# EAGLE design MesschieberV4 (EAGLE 6.4)

## Sheet 1 of 4
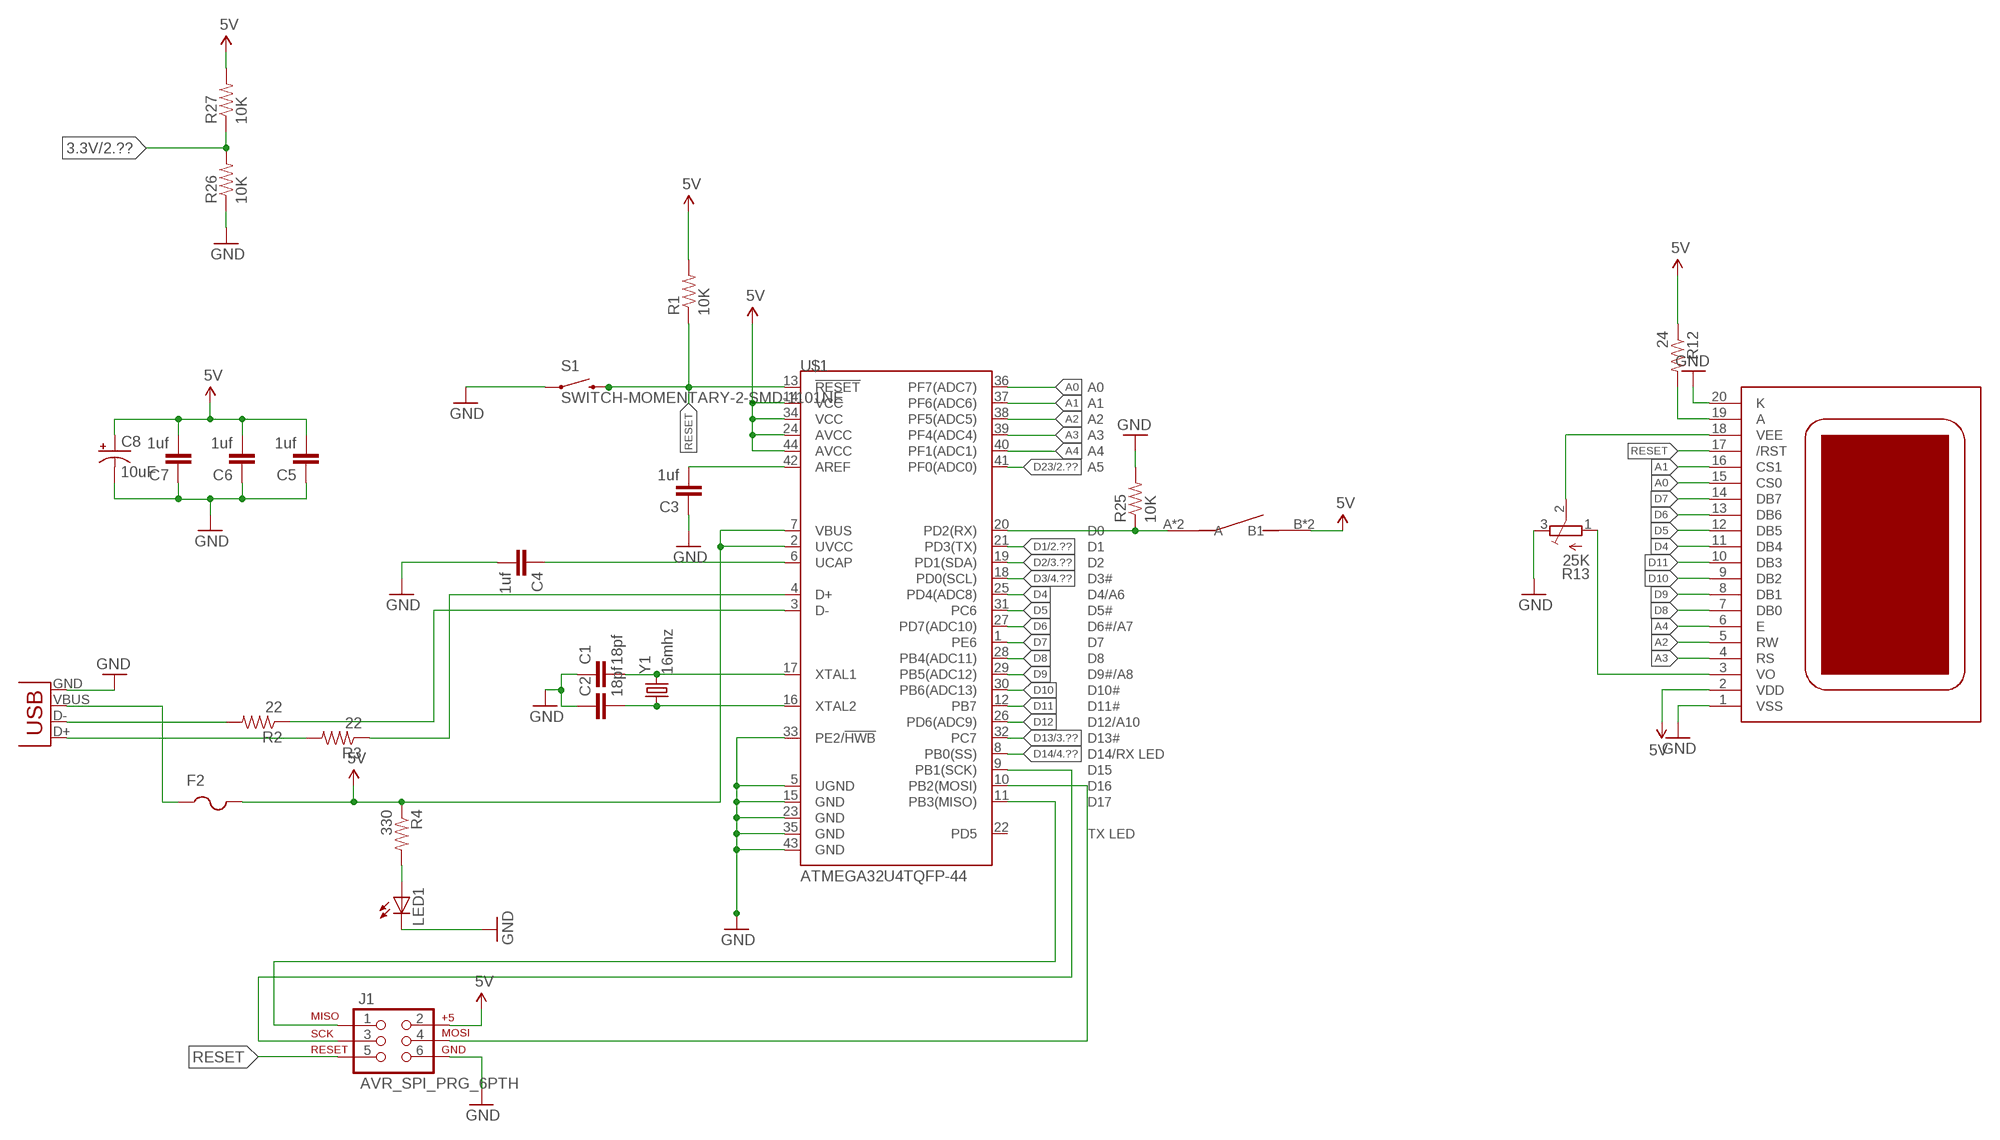
[diagram p0: schematic, sheet 1]

### Parts
C1  18pf  CAP0805  [0805]
C2  18pf  CAP0805  [0805]
C3  1uf  CAP0805  [0805]
C4  1uf  CAP0805  [0805]
C5  1uf  CAP0805  [0805]
C6  1uf  CAP0805  [0805]
C7  1uf  CAP0805  [0805]
C8  10uF  10UF-20V-10%(TANT)  [EIA3528]
F2  PTCFUSE-1812  [1812]
J1  AVR_SPI_PRG_6PTH  [2X3]
JP7  USB-SMD-NS  [USB-MINIB-NOSTOP]
LED1  LEDSML0805  [SML0805]
R1  10K  RESISTOR  [0805]
R2  22  RESISTOR  [0805]
R3  22  RESISTOR  [0805]
R4  330  RESISTOR  [0805]
R12  24  RESISTOR  [0805]
R13  25K  TRIM_EU-SM-42/43A  [SM-42/43A]
R25  10K  RESISTOR  [0805]
R26  10K  RESISTOR  [0805]
R27  10K  RESISTOR  [0805]
S1  SWITCH-MOMENTARY-2-SMD-1101NE  [TACTILE-SWITCH-1101NE]
U$1  ATMEGA32U4TQFP-44  [TQFP44]
U$2  TS12864A  [TS12864]
U$12  TASTE_R3FTL6  [TASTE_R3FTL6]
Y1  16mhz  CRYSTAL5X3  [CRYSTAL-SMD-5X3]

### Nets
3.3V: R26.2 R27.1 ; also sheet 2,3,4
5V: C5.2 C6.2 C7.2 C8.A(+) F2.2 J1.2 R1.2 R4.1 R12.1 R27.2 U$1.2(UVCC) U$1.7(VBUS) U$1.14(VCC) U$1.24(AVCC) U$1.34(VCC) U$1.44(AVCC) U$2.2(VDD) U$12.B1 U$12.B(B1) ; also sheet 2,3,4
A: R12.2 U$2.19(A)
A0: U$1.36(PF7(ADC7)) U$2.15(CS0)
A1: U$1.37(PF6(ADC6)) U$2.16(CS1)
A2: U$1.38(PF5(ADC5)) U$2.5(RW)
A3: U$1.39(PF4(ADC4)) U$2.4(RS)
A4: U$1.40(PF1(ADC1)) U$2.6(E)
D1: U$1.21(PD3(TX)) ; also sheet 2
D2: U$1.19(PD1(SDA)) ; also sheet 3
D3: U$1.18(PD0(SCL)) ; also sheet 4
D4: U$1.25(PD4(ADC8)) U$2.11(DB4)
D5: U$1.31(PC6) U$2.12(DB5)
D6: U$1.27(PD7(ADC10)) U$2.13(DB6)
D7: U$1.1(PE6) U$2.14(DB7)
D8: U$1.28(PB4(ADC11)) U$2.7(DB0)
D9: U$1.29(PB5(ADC12)) U$2.8(DB1)
D10: U$1.30(PB6(ADC13)) U$2.9(DB2)
D11: U$1.12(PB7) U$2.10(DB3)
D12: U$1.26(PD6(ADC9))
D13: U$1.32(PC7) ; also sheet 3
D14: U$1.8(PB0(SS)) ; also sheet 4
D23: U$1.41(PF0(ADC0)) ; also sheet 2
GND: C1.1 C2.1 C3.1 C4.2 C5.1 C6.1 C7.1 C8.C(-) J1.6 JP7.GND LED1.C R13.3(E) R25.2 R26.1 S1.P$1 U$1.5(UGND) U$1.15(GND) U$1.23(GND) U$1.33(PE2/!HWB) U$1.35(GND) U$1.43(GND) U$2.1(VSS) U$2.20(K) ; also sheet 2,3,4
N$1: C3.2 U$1.42(AREF)
N$2: C2.2 U$1.16(XTAL2) Y1.1
N$3: C1.2 U$1.17(XTAL1) Y1.3
N$5: JP7.D- R2.2
N$6: JP7.D+ R3.2
N$7: R3.1 U$1.4(D+)
N$8: R2.1 U$1.3(D-)
N$9: F2.1 JP7.VBUS
N$10: LED1.A R4.2
N$11: J1.3 U$1.9(PB1(SCK))
N$12: J1.1 U$1.11(PB3(MISO))
N$13: J1.4 U$1.10(PB2(MOSI))
N$14: C4.1 U$1.6(UCAP)
N$29: R25.1 U$1.20(PD2(RX)) U$12.A U$12.A1(A)
N$38: R13.1(A) U$2.3(VO)
RESET: J1.5 R1.1 S1.P$2 U$1.13(!RESET) U$2.17(/RST)
VEE: R13.2(S) U$2.18(VEE)
Unconnected: U$1.22(PD5)

## Sheet 2 of 4
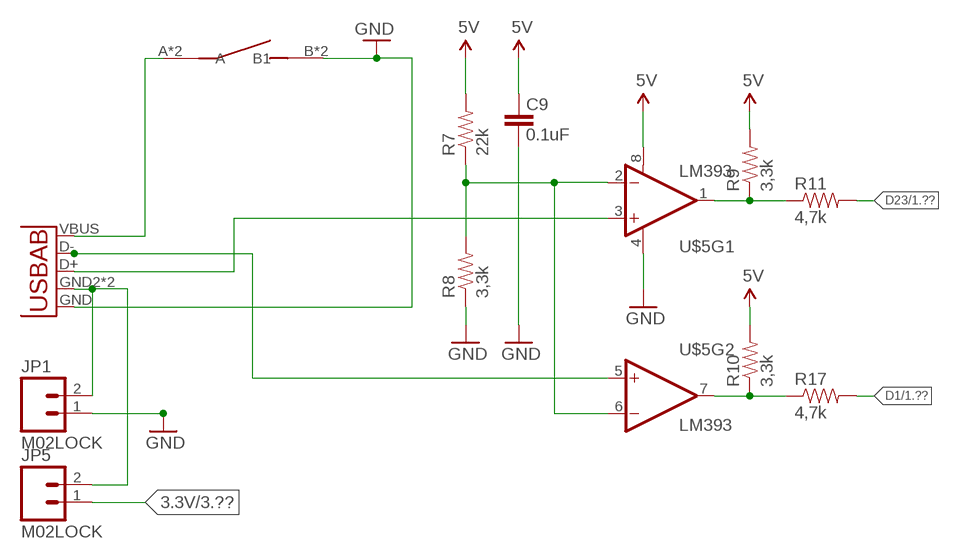
[diagram p1: schematic, sheet 2]

### Parts
C9  0.1uF  CAP0805  [0805]
JP1  M02LOCK  [1X02_LOCK]
JP5  M02LOCK  [1X02_LOCK]
R7  22k  RESISTOR  [0805]
R8  3,3k  RESISTOR  [0805]
R9  3,3k  RESISTOR  [0805]
R10  3,3k  RESISTOR  [0805]
R11  4,7k  RESISTOR  [0805]
R17  4,7k  RESISTOR  [0805]
U$3  TASTE_R3FTL6  [TASTE_R3FTL6]
U$5  LM393  [SO08]
U$7  USB-A  [USB-A]

### Nets
3.3V: JP5.1 ; also sheet 1,3,4
5V: C9.2 R7.2 R9.2 R10.2 U$5.8(V+) ; also sheet 1,3,4
D1: R17.2 ; also sheet 1
D23: R11.2 ; also sheet 1
DATA1: R9.1 R11.1 U$5.1(OUT)
GND: C9.1 JP1.1 R8.1 U$3.B1 U$3.B(B1) U$5.4(V-) U$7.GND ; also sheet 1,3,4
N$4: R7.1 R8.2 U$5.2(-IN) U$5.6(-IN)
N$15: U$5.3(+IN) U$7.D+
N$16: U$5.5(+IN) U$7.D-
N$17: U$3.A U$3.A1(A) U$7.VBUS
N$18: JP1.2 JP5.2 U$7.GND2(USBID) U$7.GND3(USBID)
SCK1: R10.1 R17.1 U$5.7(OUT)

## Sheet 3 of 4
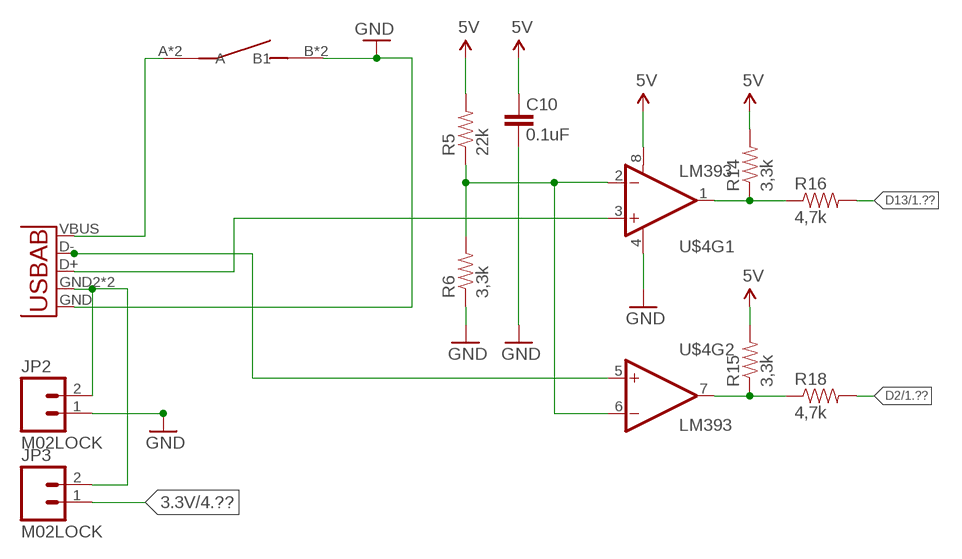
[diagram p2: schematic, sheet 3]

### Parts
C10  0.1uF  CAP0805  [0805]
JP2  M02LOCK  [1X02_LOCK]
JP3  M02LOCK  [1X02_LOCK]
R5  22k  RESISTOR  [0805]
R6  3,3k  RESISTOR  [0805]
R14  3,3k  RESISTOR  [0805]
R15  3,3k  RESISTOR  [0805]
R16  4,7k  RESISTOR  [0805]
R18  4,7k  RESISTOR  [0805]
U$4  LM393  [SO08]
U$6  USB-A  [USB-A]
U$8  TASTE_R3FTL6  [TASTE_R3FTL6]

### Nets
3.3V: JP3.1 ; also sheet 1,2,4
5V: C10.2 R5.2 R14.2 R15.2 U$4.8(V+) ; also sheet 1,2,4
D2: R18.2 ; also sheet 1
D13: R16.2 ; also sheet 1
DATA2: R14.1 R16.1 U$4.1(OUT)
GND: C10.1 JP2.1 R6.1 U$4.4(V-) U$6.GND U$8.B1 U$8.B(B1) ; also sheet 1,2,4
N$19: R5.1 R6.2 U$4.2(-IN) U$4.6(-IN)
N$20: U$4.3(+IN) U$6.D+
N$21: U$4.5(+IN) U$6.D-
N$22: U$6.VBUS U$8.A U$8.A1(A)
N$23: JP2.2 JP3.2 U$6.GND2(USBID) U$6.GND3(USBID)
SCK2: R15.1 R18.1 U$4.7(OUT)

## Sheet 4 of 4
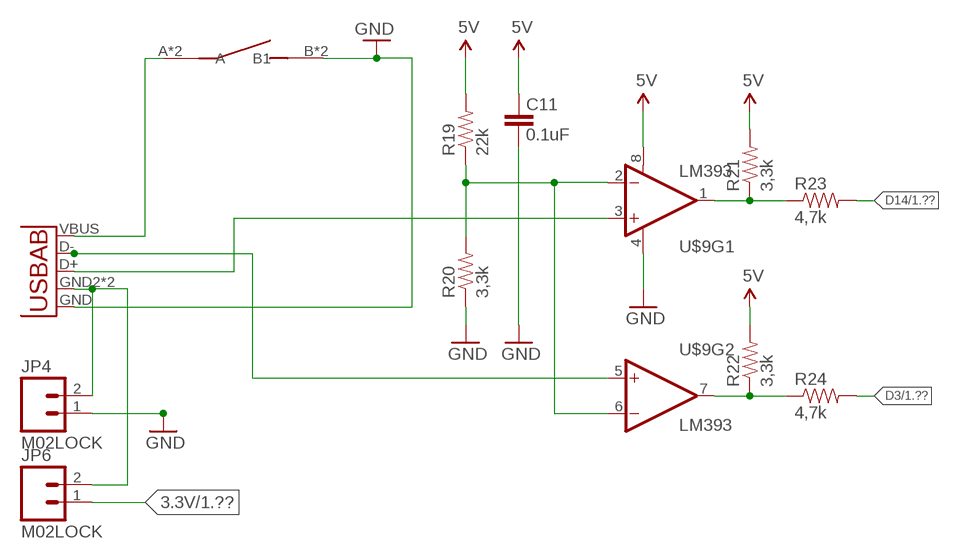
[diagram p3: schematic, sheet 4]

### Parts
C11  0.1uF  CAP0805  [0805]
JP4  M02LOCK  [1X02_LOCK]
JP6  M02LOCK  [1X02_LOCK]
R19  22k  RESISTOR  [0805]
R20  3,3k  RESISTOR  [0805]
R21  3,3k  RESISTOR  [0805]
R22  3,3k  RESISTOR  [0805]
R23  4,7k  RESISTOR  [0805]
R24  4,7k  RESISTOR  [0805]
U$9  LM393  [SO08]
U$10  USB-A  [USB-A]
U$11  TASTE_R3FTL6  [TASTE_R3FTL6]

### Nets
3.3V: JP6.1 ; also sheet 1,2,3
5V: C11.2 R19.2 R21.2 R22.2 U$9.8(V+) ; also sheet 1,2,3
D3: R24.2 ; also sheet 1
D14: R23.2 ; also sheet 1
DATA3: R21.1 R23.1 U$9.1(OUT)
GND: C11.1 JP4.1 R20.1 U$9.4(V-) U$10.GND U$11.B1 U$11.B(B1) ; also sheet 1,2,3
N$24: R19.1 R20.2 U$9.2(-IN) U$9.6(-IN)
N$25: U$9.3(+IN) U$10.D+
N$26: U$9.5(+IN) U$10.D-
N$27: U$10.VBUS U$11.A U$11.A1(A)
N$28: JP4.2 JP6.2 U$10.GND2(USBID) U$10.GND3(USBID)
SCK3: R22.1 R24.1 U$9.7(OUT)

## Library data of the parts
C1-C7 = SparkFun-Capacitors:CAP: Capacitor Standard 0603 ceramic capacitor, and 0.1" leaded capacitor.
C8 = SparkFun-Capacitors:10UF-20V-10%(TANT): CAP-08063; PROD_ID: CAP-08063
C9-C11 = SparkFun:CAP: Capacitor Standard 0603 ceramic capacitor, and 0.1" leaded capacitor.
F2 = adafruit:PTCFUSE: PTC fuses, resettable thermistors
J1 = SparkFun-Connectors:AVR_SPI_PRG_6: AVR ISP 6 Pin This is the reduced ISP connector for AVR programming. Common on Arduino. This footprint will take up less PCB space and can be used with a 10-pin to 6-pin adapter such as SKU: BOB-08508
JP1-JP6 = SparkFun-Connectors:M02: Standard 2-pin 0.1" header. Use with - straight break away headers ( PRT-00116) - right angle break away headers (PRT-00553) - swiss pins (PRT-00743) - machine pins (PRT-00117) - female headers (PRT-00115) Molex polarized connector foot print use with: PRT-08233 with associated crimp pins and housings. 2.54_SCREWTERM for use with PRT-10571. 3.5mm Screw Terminal footprints for PRT-08084 5mm Screw Terminal footprints for use with PRT-08433
JP7 = SparkFun-Connectors:USB: USB Connectors USB-B-PTH is fully proven SKU : PRT-00139/CONN-08278 USB-miniB is fully proven SKU : PRT-00587 USB-A-PCB is untested. USB-A-H is throughly reviewed, but untested. Spark Fun Electronics SKU : PRT-00437 USB-B-SMT is throughly reviewed, but untested. Needs silkscreen touching up. USB-A-S has not been used/tested USB-MB-H has not been used/tested USB-MICROB has been used. CONN-09505
LED1 = led:LED: LED OSRAM: - CHIPLED LG R971, LG N971, LY N971, LG Q971, LY Q971, LO R971, LY R971 LH N974, LH R974 LS Q976, LO Q976, LY Q976 LO Q996 - Hyper CHIPLED LW Q18S LB Q993, LB Q99A, LB R99A - SideLED LS A670, LO A670, LY A670, LG A670, LP A670 LB A673, LV A673, LT A673, LW A673 LH A674 LY A675 LS A676, LA A676, LO A676, LY A676, LW A676 LS A679, LY A679, LG A679 - Hyper Micro SIDELED® LS Y876, LA Y876, LO Y876, LY Y876 LT Y87S - SmartLED LW L88C, LW L88S LB L89C, LB L89S, LG L890 LS L89K, LO L89K, LY L89K LS L896, LA L896, LO L896, LY L896 - TOPLED LS T670, LO T670, LY T670, LG T670, LP T670 LSG T670, LSP T670, LSY T670, LOP T670, LYG T670 LG T671, LOG T671, LSG T671 LB T673, LV T673, LT T673, LW T673 LH T674 LS T676, LA T676, LO T676, LY T676, LB T676, LH T676, LSB T676, LW T676 LB T67C, LV T67C, LT T67C, LS T67K, LO T67K, LY T67K, LW E67C LS E67B, LA E67B, LO E67B, LY E67B, LB E67C, LV E67C, LT E67C LW T67C LS T679, LY T679, LG T679 LS T770, LO T770, LY T770, LG T770, LP T770 LB T773, LV T773, LT T773, LW T773 LH T774 LS E675, LA E675, LY E675, LS T675 LS T776, LA T776, LO T776, LY T776, LB T776 LHGB T686 LT T68C, LB T68C - Hyper Mini TOPLED® LB M676 - Mini TOPLED Santana® LG M470 LS M47K, LO M47K, LY M47K Source: http://www.osram.convergy.de LUXEON: - LUMILED® LXK2-PW12-R00, LXK2-PW12-S00, LXK2-PW14-U00, LXK2-PW14-V00 LXK2-PM12-R00, LXK2-PM12-S00, LXK2-PM14-U00 LXK2-PE12-Q00, LXK2-PE12-R00, LXK2-PE12-S00, LXK2-PE14-T00, LXK2-PE14-U00 LXK2-PB12-K00, LXK2-PB12-L00, LXK2-PB12-M00, LXK2-PB14-N00, LXK2-PB14-P00, LXK2-PB14-Q00 LXK2-PR12-L00, LXK2-PR12-M00, LXK2-PR14-Q00, LXK2-PR14-R00 LXK2-PD12-Q00, LXK2-PD12-R00, LXK2-PD12-S00 LXK2-PH12-R00, LXK2-PH12-S00 LXK2-PL12-P00, LXK2-PL12-Q00, LXK2-PL12-R00 Source: www.luxeon.com KINGBRIGHT: KA-3528ASYC Source: www.kingbright.com
R1-R12 R14-R27 = SparkFun:RESISTOR: Resistor Basic schematic elements and footprints for 0603, 1206, and PTH 1/10th watt (small) resistors.
R13 = pot:TRIM_EU-: POTENTIOMETER
S1 = SparkFun-Electromechanical:SWITCH-MOMENTARY-2: Various NO switches- pushbuttons, reed, etc
U$1 = SparkFun-DigitalIC:ATMEGA32U4: Atmel 44-pin 8-bit Microcontroller with 32KBytes of ISP Flash and USB Controller
U$2 = adafruit:TS12864A: KS0108 based display. Some have slightly different pinouts so double check!
U$3 U$8 U$11 U$12 = andi:TASTE_R3FTL6: http://www.reichelt.de/Kurzhubtaster/TASTER-3FTL6/3/index.html?&ACTION=3&LA=2&ARTICLE=79697&GROUPID=3278&artnr=TASTER+3FTL6
U$4 U$5 U$9 = SparkFun-AnalogIC:LM393: Low-voltage comparator
U$6 U$7 U$10 = andi:USB-A
Y1 = SparkFun-FreqCtrl:CRYSTAL: Various standard crystals. Proven footprints. Spark Fun Electronics SKU : COM-00534

## Net classes
0 default: width 0.203 mm, clearance 0.205 mm
1 vcc: width 0.254 mm, clearance 0.205 mm to class 0, clearance 0.205 mm

## Board
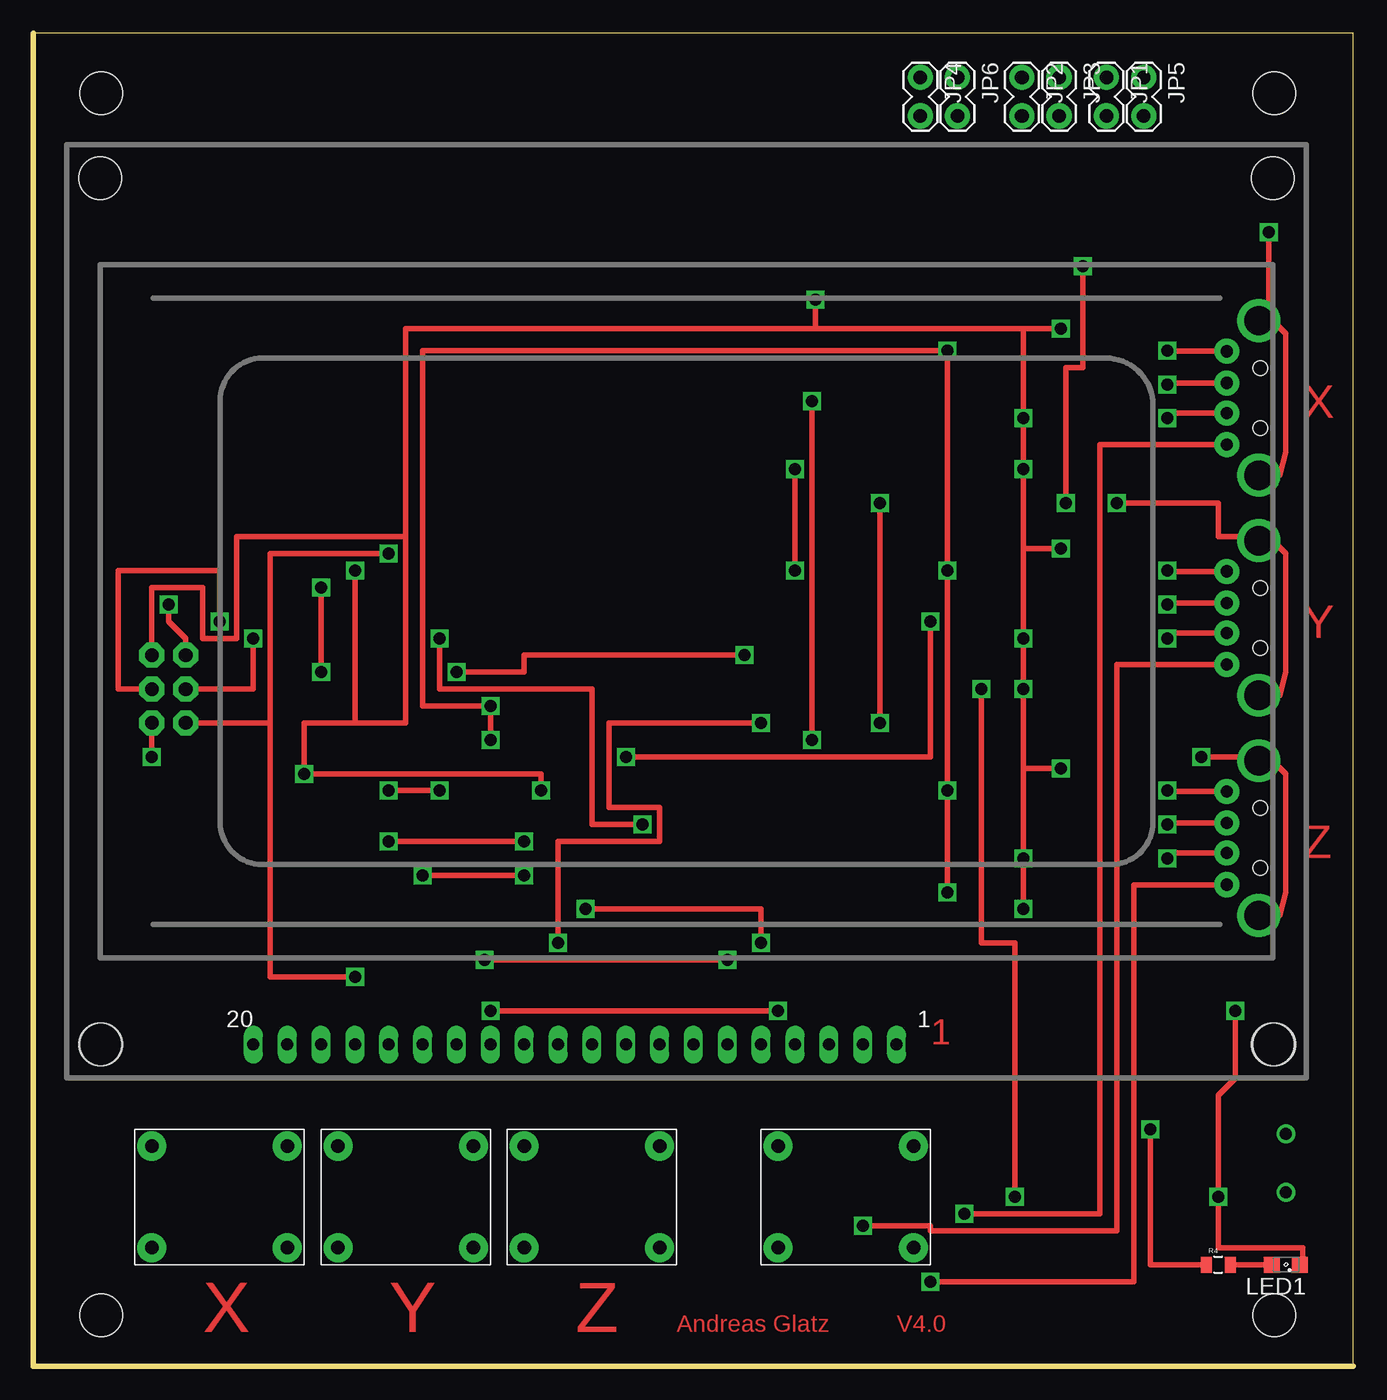
[diagram p4: board, top side]
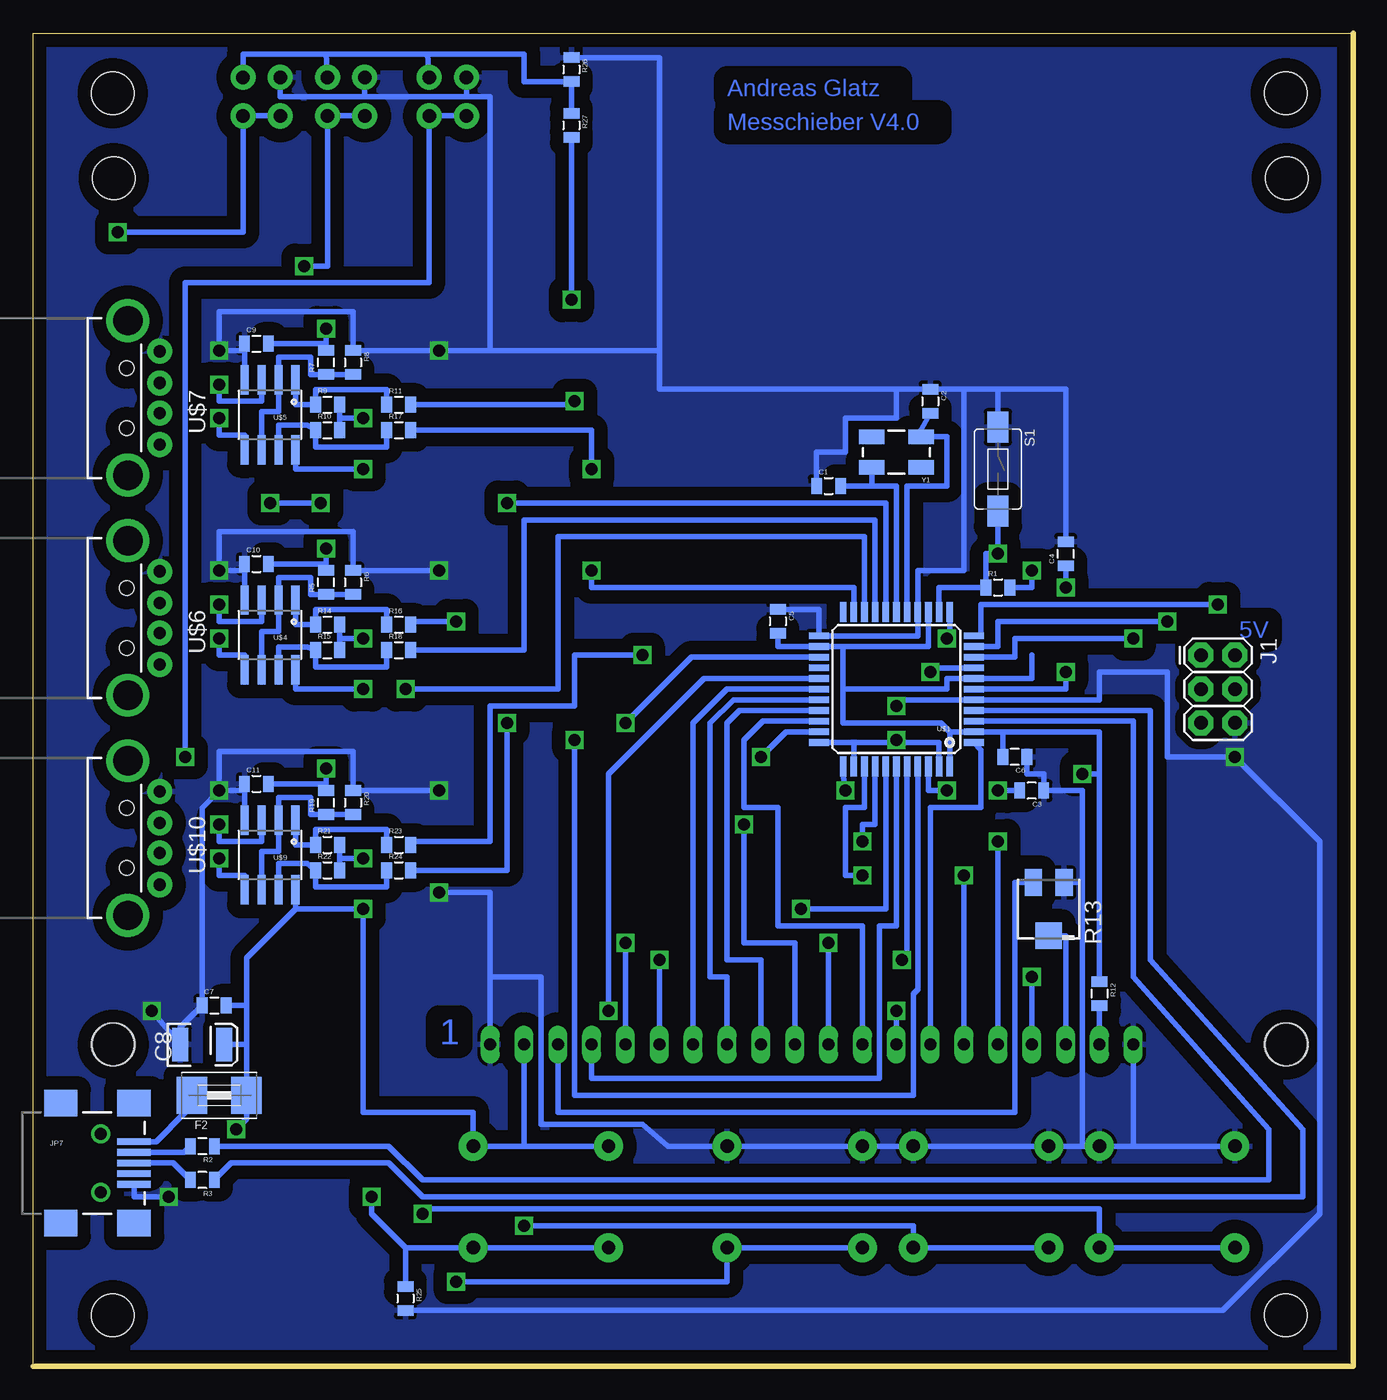
[diagram p5: board, bottom side, seen from below]

Size 99.04 x 100 mm. Coordinates in mm from the lower left corner, seen from the top.
Outline: 0,0 99.04,0 99.04,100 0,100 0,0
Copper layers (1*16): Top 0.035mm / dielectric 1.5mm / Bottom 0.035mm
Design rules "default": minimum track width 10mil, minimum drill 24mil, track to track 8mil, track to pad 8mil, pad to pad 8mil, via to via 8mil, smd to smd 8mil, copper to edge 40mil, drill to drill 8mil, minimum pad ring 10mil, minimum via ring 8mil, stop-mask expansion 4mil, vias tented up to drill 0mil, thermal gap 10mil
Holes 3.2 mm at 5.08,95.5 93.09,95.5 93.09,24.13 5.08,24.13 5.08,3.81 93.09,3.81

### Footprints (pad centres in the part's own frame; a part is rotated, then mirrored left to right if it is on the bottom)
0805 = smd 0.8 x 1.2: 1 -0.9,0; 2 0.9,0
EIA3528 = smd 1.2 x 2.5: A 1.65,0; C -1.65,0
1812 = smd 2.286 x 2.794: 1 -2.046,0; 2 2.046,0
2X3 = drill 1.016 pad 1.88 octagon: 1 0,0; 2 0,2.54; 3 2.54,0; 4 2.54,2.54; 5 5.08,0; 6 5.08,2.54
1X02_LOCK = drill 1.016 pad 1.88: 1 -0.178,0; 2 2.718,0
USB-MINIB-NOSTOP = smd 2.5 x 0.5: D+ 2.5,0; D- 2.5,0.8; GND 2.5,-1.6; ID 2.5,-0.8; VBUS 2.5,1.6 | smd 2.5 x 2: G1 -3,-4.5; G2 -3,4.5; G3 2.5,4.5; G4 2.5,-4.5 | drill 0.9 pad 0.8: H1 0,2.2 | drill 0.9 pad 0.787: H2 0,-2.2
SML0805 = smd 1.2 x 1.2: A 1.05,0; C -1.05,0
SM-42/43A = smd 2 x 1.3: 1 2,1.15; 3 2,-1.15 | smd 2 x 2: 2 -2,0
TACTILE-SWITCH-1101NE = smd 2.3 x 1.6: P$1 -3.15,0; P$2 3.15,0
TQFP44 = smd 1.5 x 0.5: 1 -5.8,4; 2 -5.8,3.2; 3 -5.8,2.4; 4 -5.8,1.6; 5 -5.8,0.8; 6 -5.8,0; 7 -5.8,-0.8; 8 -5.8,-1.6; 9 -5.8,-2.4; 10 -5.8,-3.2; 11 -5.8,-4; 23 5.8,-4; 24 5.8,-3.2; 25 5.8,-2.4; 26 5.8,-1.6; 27 5.8,-0.8; 28 5.8,0; 29 5.8,0.8; 30 5.8,1.6; 31 5.8,2.4; 32 5.8,3.2; 33 5.8,4 | smd 0.5 x 1.5: 12 -4,-5.8; 13 -3.2,-5.8; 14 -2.4,-5.8; 15 -1.6,-5.8; 16 -0.8,-5.8; 17 0,-5.8; 18 0.8,-5.8; 19 1.6,-5.8; 20 2.4,-5.8; 21 3.2,-5.8; 22 4,-5.8; 34 4,5.8; 35 3.2,5.8; 36 2.4,5.8; 37 1.6,5.8; 38 0.8,5.8; 39 0,5.8; 40 -0.8,5.8; 41 -1.6,5.8; 42 -2.4,5.8; 43 -3.2,5.8; 44 -4,5.8
TS12864 = drill 0.9 long: 1 48.26,0; 2 45.72,0; 3 43.18,0; 4 40.64,0; 5 38.1,0; 6 35.56,0; 7 33.02,0; 8 30.48,0; 9 27.94,0; 10 25.4,0; 11 22.86,0; 12 20.32,0; 13 17.78,0; 14 15.24,0; 15 12.7,0; 16 10.16,0; 17 7.62,0; 18 5.08,0; 19 2.54,0; 20 0,0 | hole 3.2: -11.5,65; 76.5,65; -11.5,0; 76.5,0
TASTE_R3FTL6 = drill 1 pad 2.184: A -1.27,0; A1 8.89,0; B 8.89,7.62; B1 -1.27,7.62
SO08 = smd 0.61 x 2.21: 1 -1.905,-2.616; 2 -0.635,-2.616; 3 0.635,-2.616; 4 1.905,-2.616; 5 1.905,2.616; 6 0.635,2.616; 7 -0.635,2.616; 8 -1.905,2.616
USB-A = drill 0.914 pad 1.88: D+ 10.02,1.127; D- 10.02,-1.127; GND 10.02,3.5; VBUS 10.02,-3.5 | drill 2.2: GND2 7.62,-5.8; GND3 7.62,5.8 | hole 1.1: 7.52,2.25; 7.52,-2.25
CRYSTAL-SMD-5X3 = smd 1.9 x 1.1: 1 -1.85,-1.15; 2 1.85,-1.15; 3 1.85,1.15; 4 -1.85,1.15

### Placement (x,y rotation side)
C1  39.37,66.04 0 bottom
C2  31.75,72.39 270 bottom
C3  24.13,43.18 180 bottom
C4  21.59,60.96 90 bottom
C5  43.18,55.88 270 bottom
C6  25.4,45.72 180 bottom
C7  85.47,27.05 0 bottom
C8  86.36,24.13 0 bottom
C9  82.3,76.71 0 bottom
C10  82.3,60.2 0 bottom
C11  82.3,43.69 0 bottom
F2  85.09,20.32 0 bottom
J1  11.43,53.34 270 bottom
JP1  80.52,96.52 270 top
JP2  74.17,96.52 270 top
JP3  76.96,96.52 270 top
JP4  66.55,96.52 270 top
JP5  83.31,96.52 270 top
JP6  69.34,96.52 270 top
JP7  93.98,15.24 0 bottom
LED1  93.98,7.62 180 top
R1  26.67,58.42 0 bottom
R2  86.36,16.51 180 bottom
R3  86.36,13.97 180 bottom
R4  88.9,7.62 0 top
R5  77.09,58.8 90 bottom
R6  75.06,58.8 270 bottom
R7  77.09,75.31 90 bottom
R8  75.06,75.31 270 bottom
R9  76.96,72.14 0 bottom
R10  76.96,70.23 0 bottom
R11  71.63,72.14 0 bottom
R12  19.05,27.94 270 bottom
R13  22.86,34.29 90 bottom
R14  76.96,55.63 0 bottom
R15  76.96,53.72 0 bottom
R16  71.63,55.63 0 bottom
R17  71.63,70.23 0 bottom
R18  71.63,53.72 0 bottom
R19  77.09,42.29 90 bottom
R20  75.06,42.29 270 bottom
R21  76.96,39.12 0 bottom
R22  76.96,37.21 0 bottom
R23  71.63,39.12 0 bottom
R24  71.63,37.21 0 bottom
R25  71.12,5.08 270 bottom
R26  58.67,97.28 270 bottom
R27  58.67,93.09 270 bottom
S1  26.67,67.31 270 bottom
U$1  34.29,50.8 180 bottom
U$2  16.51,24.13 0 top
U$3  10.16,8.89 0 top
U$4  81.28,54.86 180 bottom
U$5  81.28,71.37 180 bottom
U$6  99.57,56.13 0 bottom
U$7  99.57,72.64 0 bottom
U$8  24.13,8.89 0 top
U$9  81.28,38.35 180 bottom
U$10  99.57,39.62 0 bottom
U$11  38.1,8.89 0 top
U$12  57.15,8.89 0 top
Y1  34.29,68.58 180 bottom

### Tracks (layer width: path | path; a pad name or v marks a point on that pad's centre or on a via)
3.3V
  Bottom 0.406: JP5.1 83.31,98.42 77.09,98.42 | JP3.1 77.09,98.42 | 77.09,98.42 69.47,98.42 | JP6.1 69.47,98.42 | 69.47,98.42 62.23,98.42 62.23,96.38 R26.2 R27.1
5V  (via drill 0.9)
  Top 0.406: v24.13,59.69 24.13,48.26 | 24.13,48.26 20.32,48.26 v20.32,44.45 38.1,44.45 v38.1,43.18 | v77.09,77.85 74.3,77.85 | 74.3,77.85 v74.3,71.12 v74.3,67.31 74.3,61.34 | v77.09,61.34 74.3,61.34 | 74.3,61.34 v74.3,54.61 v74.3,50.8 74.3,44.83 | v74.3,34.29 v74.3,38.1 74.3,44.83 | v77.09,44.83 74.3,44.83 | 74.3,77.85 58.67,77.85 | 58.67,77.85 v58.67,80.01 | 58.67,77.85 27.94,77.85 27.94,62.23 | 27.94,62.23 27.94,48.26 24.13,48.26 | J1.2 8.89,58.42 12.7,58.42 12.7,54.61 15.24,54.61 15.24,62.23 27.94,62.23 | v83.82,17.78 83.82,7.62 R4.1
  Bottom 0.406: U$1.2 30.29,47.6 | U$1.2 26.3,47.6 C6.2 | 24.13,53.34 24.13,51.6 U$1.7 30.48,51.6 30.48,50.8 38.29,50.8 | U$1.2 19.05,47.6 R12.1 19.05,44.45 v20.32,44.45 | 38.29,54 U$1.24 43.18,54 C5.2 | 38.29,54 38.29,50.8 | U$1.14 31.89,54 38.29,54 | U$1.44 30.29,47.6 | 38.29,50.8 38.29,48.26 30.95,48.26 30.29,47.6 | U$1.34 38.29,44.45 v38.1,43.18 | R1.2 24.13,58.42 v24.13,59.69 | R9.2 R10.2 76.06,69.85 76.07,69.85 76.07,71.12 v74.3,71.12 | C9.2 77.09,76.71 R7.2 v77.09,77.85 | U$5.8 79.38,67.31 v74.3,67.31 | R14.2 R15.2 76.06,53.34 76.07,53.34 76.07,54.61 v74.3,54.61 | C10.2 77.09,60.2 R5.2 v77.09,61.34 | U$4.8 79.38,50.8 v74.3,50.8 | R21.2 R22.2 76.06,36.83 76.07,36.83 76.07,38.1 v74.3,38.1 | C11.2 77.09,43.69 R19.2 v77.09,44.83 | U$9.8 79.38,34.29 | 79.38,34.29 v74.3,34.29 74.3,19.05 66.04,19.05 U$12.B 62.23,16.51 | R27.2 v58.67,80.01 | U$2.2 62.23,16.51 | 62.23,16.51 U$12.B1 | F2.2 83.04,27.05 | 79.38,34.29 83.04,30.62 83.04,27.05 | F2.2 83.04,24.13 C8.A | 83.04,27.05 C7.2 | F2.2 83.04,18.56 v83.82,17.78
A
  Bottom 0.406: U$2.19 R12.2
A0  (via drill 0.9)
  Top 0.406: v36.83,36.83 v29.21,36.83
  Bottom 0.406: U$1.36 36.69,41.91 38.1,41.91 38.1,36.83 v36.83,36.83 | v29.21,36.83 U$2.15
A1  (via drill 0.9)
  Top 0.406: v36.83,39.37 v26.67,39.37
  Bottom 0.406: U$1.37 35.89,40.64 36.83,40.64 v36.83,39.37 | v26.67,39.37 U$2.16
A2  (via drill 0.9)
  Top 0.406: v54.61,31.75 54.61,34.29 v41.44,34.29
  Bottom 0.406: v54.61,31.75 U$2.5 | U$1.38 35.09,34.29 v41.44,34.29
A3
  Bottom 0.406: U$1.39 34.29,33.02 35.56,33.02 35.56,21.59 57.15,21.59 U$2.4
A4  (via drill 0.9)
  Top 0.406: v33.87,30.48 v52.07,30.48
  Bottom 0.406: v52.07,30.48 U$2.6 | U$1.40 33.49,30.86 v33.87,30.48
D1  (via drill 0.9)
  Top 0.406: v57.15,59.69 v57.15,67.31
  Bottom 0.406: U$1.21 37.49,58.42 57.15,58.42 v57.15,59.69 | v57.15,67.31 57.15,70.23 R17.2
D2
  Bottom 0.406: U$1.19 35.89,63.5 62.23,63.5 62.23,53.72 R18.2
D3  (via drill 0.9)
  Top 0.406: v63.5,48.26 v63.5,64.77
  Bottom 0.406: U$1.18 35.09,64.77 v63.5,64.77 | R24.2 63.5,37.21 v63.5,48.26
D4  (via drill 0.9)
  Top 0.406: v54.61,48.26 43.18,48.26 43.18,41.91 46.99,41.91 46.99,39.37 39.37,39.37 v39.37,31.75
  Bottom 0.406: U$1.25 49.67,53.2 v54.61,48.26 | v39.37,31.75 U$2.11
D5
  Bottom 0.406: U$1.31 44.31,48.4 45.72,46.99 45.72,41.91 43.18,41.91 43.18,33.02 36.83,33.02 U$2.12
D6  (via drill 0.9)
  Top 0.406: v34.29,26.67 v55.88,26.67
  Bottom 0.406: U$1.27 48.73,51.6 55.88,44.45 v55.88,26.67 | U$2.13 v34.29,26.67
D7
  Bottom 0.406: U$2.14 31.75,41.91 27.94,41.91 27.94,46.25 U$1.1
D8
  Bottom 0.406: U$2.7 49.53,48.26 46.99,50.8 U$1.28
D9
  Bottom 0.406: U$1.29 46.52,50 48.26,48.26 48.26,29.21 46.99,29.21 U$2.8
D10
  Bottom 0.406: U$1.30 46.05,49.2 46.99,48.26 46.99,30.48 44.45,30.48 U$2.9
D11  (via drill 0.9)
  Top 0.406: v45.72,40.64 41.91,40.64 41.91,50.8 30.48,50.8 v30.48,54.61
  Bottom 0.406: v45.72,40.64 45.72,31.75 41.91,31.75 U$2.10 | U$1.12 30.29,54.61 v30.48,54.61
D13  (via drill 0.9)
  Top 0.406: v44.45,45.72 67.31,45.72 v67.31,55.88
  Bottom 0.406: U$1.32 42.57,47.6 v44.45,45.72 | v67.31,55.88 70.73,55.88 R16.2
D14  (via drill 0.9)
  Top 0.406: v31.75,52.07 36.83,52.07 36.83,53.34 v53.34,53.34
  Bottom 0.406: U$1.8 31.75,52.4 v31.75,52.07 | v53.34,53.34 58.42,53.34 58.42,49.53 64.77,49.53 64.77,39.37 70.47,39.37 R23.2
D23  (via drill 0.9)
  Top 0.406: v58.42,46.99 v58.42,72.39
  Bottom 0.406: v58.42,46.99 58.42,20.32 33.02,20.32 33.02,27.94 32.69,28.27 U$1.41 | R11.2 58.42,72.14 v58.42,72.39
DATA1
  Bottom 0.406: U$5.1 79.38,72.14 R9.1 77.86,73.28 72.53,73.28 R11.1
DATA2
  Bottom 0.406: U$4.1 79.38,55.63 R14.1 77.86,56.77 72.53,56.77 R16.1
DATA3
  Bottom 0.406: U$9.1 79.38,39.12 R21.1 77.86,40.26 72.53,40.26 R23.1
GND  (via drill 0.9)
  Top 0.406: v34.29,46.99 v34.29,49.53 29.21,49.53 29.21,76.2 v68.58,76.2 v68.58,59.69 v68.58,43.18 v68.58,35.56 | U$7.GND 85.09,76.14 v85.09,76.2 | U$6.GND 85.09,59.63 v85.09,59.69 | U$10.GND 85.09,43.12 v85.09,43.18 | J1.6 v8.89,45.72 | LED1.C 95.25,7.62 95.25,8.89 88.9,8.89 v88.9,12.7 88.9,20.32 90.17,21.59 v90.17,26.67
  Bottom 0.406: C1.1 40.27,68.58 38.1,68.58 38.1,71.12 34.29,71.12 34.29,73.29 | C6.1 24.5,44.45 23.23,44.45 C3.1 20.32,43.18 20.32,36.29 | U$1.43 31.09,46.8 34.29,46.8 | 34.29,46.8 37.49,46.8 | 37.49,46.8 U$1.33 | U$1.35 37.49,46.8 | v34.29,46.99 34.29,46.8 | C5.1 40.09,56.78 U$1.23 32.69,54.8 U$1.15 32.69,59.69 29.21,59.69 29.21,73.29 C2.1 | C4.2 21.59,73.29 26.67,73.29 | 26.67,73.29 C2.1 | 83.2,76.2 v85.09,76.2 85.09,79.12 75.06,79.12 R8.1 v68.58,76.2 64.77,76.2 | 83.2,76.2 C9.1 | U$5.4 83.2,76.2 | 83.2,59.69 v85.09,59.69 85.09,62.61 75.06,62.61 R6.1 v68.58,59.69 | 83.2,59.69 C10.1 | U$4.4 83.2,59.69 | v85.09,43.18 83.2,43.18 | 83.2,43.18 C11.1 | U$9.4 83.2,43.18 | v85.09,43.18 85.09,46.1 75.06,46.1 R20.1 v68.58,43.18 | JP4.1 66.55,95.25 | JP2.1 74.17,95.25 | 74.17,95.25 80.52,95.25 JP1.1 | 66.55,95.25 64.77,95.25 64.77,76.2 | U$3.B1 U$3.B | 20.32,16.51 U$8.B1 U$8.B U$11.B1 U$11.B 51.44,16.51 53.34,18.16 60.96,18.16 60.96,29.21 64.77,29.21 | U$3.B 20.32,16.51 | U$2.1 64.77,29.21 | 64.77,29.21 64.77,35.56 v68.58,35.56 | 74.17,95.25 66.55,95.25 | C2.1 34.29,73.29 | 34.29,73.29 52.07,73.29 52.07,76.2 | 52.07,76.2 64.77,76.2 | R26.1 52.07,98.18 52.07,76.2 | 20.32,36.29 20.32,16.51 | R13.3 20.32,36.29 | U$3.B 16.51,16.51 U$2.20 | S1.P$1 26.67,73.29 | v34.29,49.53 34.29,50 U$1.5 19.05,50 19.05,52.07 13.97,52.07 13.97,45.72 v8.89,45.72 2.54,39.37 2.54,11.43 9.79,4.18 R25.2 | v85.09,43.18 86.37,41.9 C7.1 88.01,25.41 C8.C v90.17,26.67 | JP7.GND 91.48,12.7 v88.9,12.7
  pour Bottom (isolate 1.016): 0,100.33 0,0 99.06,0 99.06,100.33
N$1  (via drill 0.9)
  Top 0.406: v30.48,43.18 v26.67,43.18
  Bottom 0.406: U$1.42 31.89,43.18 v30.48,43.18 | v26.67,43.18 C3.2
N$2
  Bottom 0.406: U$1.16 33.49,66.04 30.48,66.04 30.48,69.73 Y1.1 32.44,70.22 C2.2
N$3
  Bottom 0.406: U$1.17 34.29,66.04 36.14,66.04 | 36.14,66.04 C1.2 | 36.14,66.04 Y1.3
N$4
  Bottom 0.406: R8.2 R7.1 78.23,74.41 78.23,75.69 80.64,75.69 U$5.2 80.64,71.63 81.92,71.63 U$5.6
N$5
  Bottom 0.406: JP7.D- 87.73,16.04 R2.2
N$6
  Bottom 0.406: JP7.D+ 88.53,15.24 R3.2
N$7
  Bottom 0.406: U$1.4 15.24,49.2 15.24,30.48 3.81,17.78 3.81,12.7 69.85,12.7 72.39,15.24 84.19,15.24 R3.1
N$8
  Bottom 0.406: U$1.3 16.51,48.4 16.51,29.21 6.35,17.78 6.35,13.97 69.85,13.97 72.39,16.51 R2.1
N$9
  Bottom 0.406: JP7.VBUS 89.84,16.84 87.63,19.05 87.63,19.83 F2.1
N$10
  Top 0.406: LED1.A R4.2
N$11  (via drill 0.9)
  Top 0.406: J1.3 16.51,50.8 v16.51,54.61
  Bottom 0.406: U$1.9 25.4,53.2 25.4,54.61 v16.51,54.61
N$12  (via drill 0.9)
  Top 0.406: J1.1 11.43,54.61 10.16,55.88 v10.16,57.15
  Bottom 0.406: U$1.11 27.94,54.8 27.94,57.15 v10.16,57.15
N$13  (via drill 0.9)
  Top 0.406: J1.4 6.35,50.8 6.35,59.69 13.97,59.69 v13.97,55.88
  Bottom 0.406: v13.97,55.88 26.67,55.88 26.67,54 U$1.10
N$14  (via drill 0.9)
  Top 0.406: v21.59,52.07 v21.59,58.42
  Bottom 0.406: U$1.6 21.59,50.8 v21.59,52.07 | v21.59,58.42 C4.1
N$15  (via drill 0.9)
  Top 0.406: U$7.D+ 85.09,73.77 v85.09,73.66
  Bottom 0.406: v85.09,73.66 85.09,72.39 81.92,72.39 U$5.3
N$16  (via drill 0.9)
  Top 0.406: U$7.D- 85.09,71.52 v85.09,71.12
  Bottom 0.406: v85.09,71.12 85.09,69.85 83.19,69.85 U$5.5
N$17  (via drill 0.9)
  Top 0.406: U$7.VBUS 80.01,69.14 80.01,11.43 v69.85,11.43
  Bottom 0.406: U$3.A U$3.A1 19.05,11.81 69.85,11.81 v69.85,11.43
N$18  (via drill 0.9)
  Top 0.406: U$7.GND2 93.51,66.84 93.98,68.58 93.98,77.47 93.01,78.44 U$7.GND3 92.71,78.44 v92.71,85.09
  Bottom 0.406: JP1.2 JP5.2 83.31,85.09 v92.71,85.09
N$19
  Bottom 0.406: R6.2 R5.1 78.23,57.9 78.23,59.18 80.64,59.18 U$4.2 80.64,55.12 81.92,55.12 U$4.6
N$20  (via drill 0.9)
  Top 0.406: U$6.D+ 85.09,57.26 v85.09,57.15
  Bottom 0.406: v85.09,57.15 85.09,55.88 81.92,55.88 U$4.3
N$21  (via drill 0.9)
  Top 0.406: U$6.D- 85.09,55.01 v85.09,54.61
  Bottom 0.406: v85.09,54.61 85.09,53.34 83.19,53.34 U$4.5
N$22  (via drill 0.9)
  Top 0.406: U$6.VBUS 81.28,52.63 81.28,10.16 67.31,10.16 67.31,10.54 v62.23,10.54
  Bottom 0.406: U$8.A U$8.A1 33.02,10.54 v62.23,10.54
N$23  (via drill 0.9)
  Top 0.406: U$6.GND2 93.51,50.33 93.98,52.07 93.98,60.96 93.01,61.93 U$6.GND3 91.65,62.23 88.9,62.23 88.9,64.77 v81.28,64.77 | v77.47,64.77 77.47,74.93 78.74,74.93 78.74,81.28 v78.74,82.55
  Bottom 0.406: JP2.2 JP3.2 76.96,82.55 v78.74,82.55 | v81.28,64.77 v77.47,64.77
N$24
  Bottom 0.406: R20.2 R19.1 78.23,41.39 78.23,42.67 80.64,42.67 U$9.2 80.64,38.61 81.92,38.61 U$9.6
N$25  (via drill 0.9)
  Top 0.406: U$10.D+ 85.09,40.75 v85.09,40.64
  Bottom 0.406: v85.09,40.64 85.09,39.37 81.92,39.37 U$9.3
N$26  (via drill 0.9)
  Top 0.406: U$10.D- 85.09,38.5 v85.09,38.1
  Bottom 0.406: v85.09,38.1 85.09,36.83 83.19,36.83 U$9.5
N$27  (via drill 0.9)
  Top 0.406: U$10.VBUS 82.55,36.12 82.55,6.35 v67.31,6.35
  Bottom 0.406: U$11.A U$11.A1 46.99,6.35 v67.31,6.35
N$28  (via drill 0.9)
  Top 0.406: U$10.GND2 93.51,33.82 93.98,35.56 93.98,44.45 93.01,45.42 U$10.GND3 91.95,45.72 v87.63,45.72
  Bottom 0.406: JP4.2 JP6.2 69.34,81.28 87.63,81.28 v87.63,45.72
N$29  (via drill 0.9)
  Top 0.406: v73.66,12.7 73.66,31.75 71.12,31.75 v71.12,50.8
  Bottom 0.406: v73.66,12.7 73.66,11.43 71.12,8.89 | U$12.A U$12.A1 71.12,8.89 | v71.12,50.8 59.69,50.8 59.69,62.23 36.69,62.23 U$1.20 | R25.1 71.12,8.89
N$38
  Bottom 0.406: R13.1 25.4,36.29 25.4,19.05 59.69,19.05 U$2.3
RESET  (via drill 0.9)
  Top 0.406: 17.78,48.26 17.78,29.21 v24.13,29.21 | 17.78,48.26 17.78,60.96 v26.67,60.96 | J1.5 17.78,48.26
  Bottom 0.406: U$1.13 31.09,58.42 R1.1 27.57,60.96 v26.67,60.96 S1.P$2 | v24.13,29.21 U$2.17
SCK1
  Bottom 0.406: U$5.7 80.64,70.61 78.49,70.61 R10.1 77.86,68.96 72.53,68.96 R17.1
SCK2
  Bottom 0.406: U$4.7 80.64,53.98 78.49,53.98 R15.1 77.86,52.45 72.53,52.45 R18.1
SCK3
  Bottom 0.406: U$9.7 80.64,37.72 78.49,37.72 R22.1 77.86,35.94 72.53,35.94 R24.1
VEE
  Bottom 0.406: U$2.18 21.59,32.29 R13.2

### Text on the board
Top: X | Y | Z | 1 | X | Y | Z | Andreas Glatz | V4.0
Bottom: Andreas Glatz | Messchieber V4.0 | 5V | 1